# EAGLE schematic Arch Max (EAGLE 6.4)
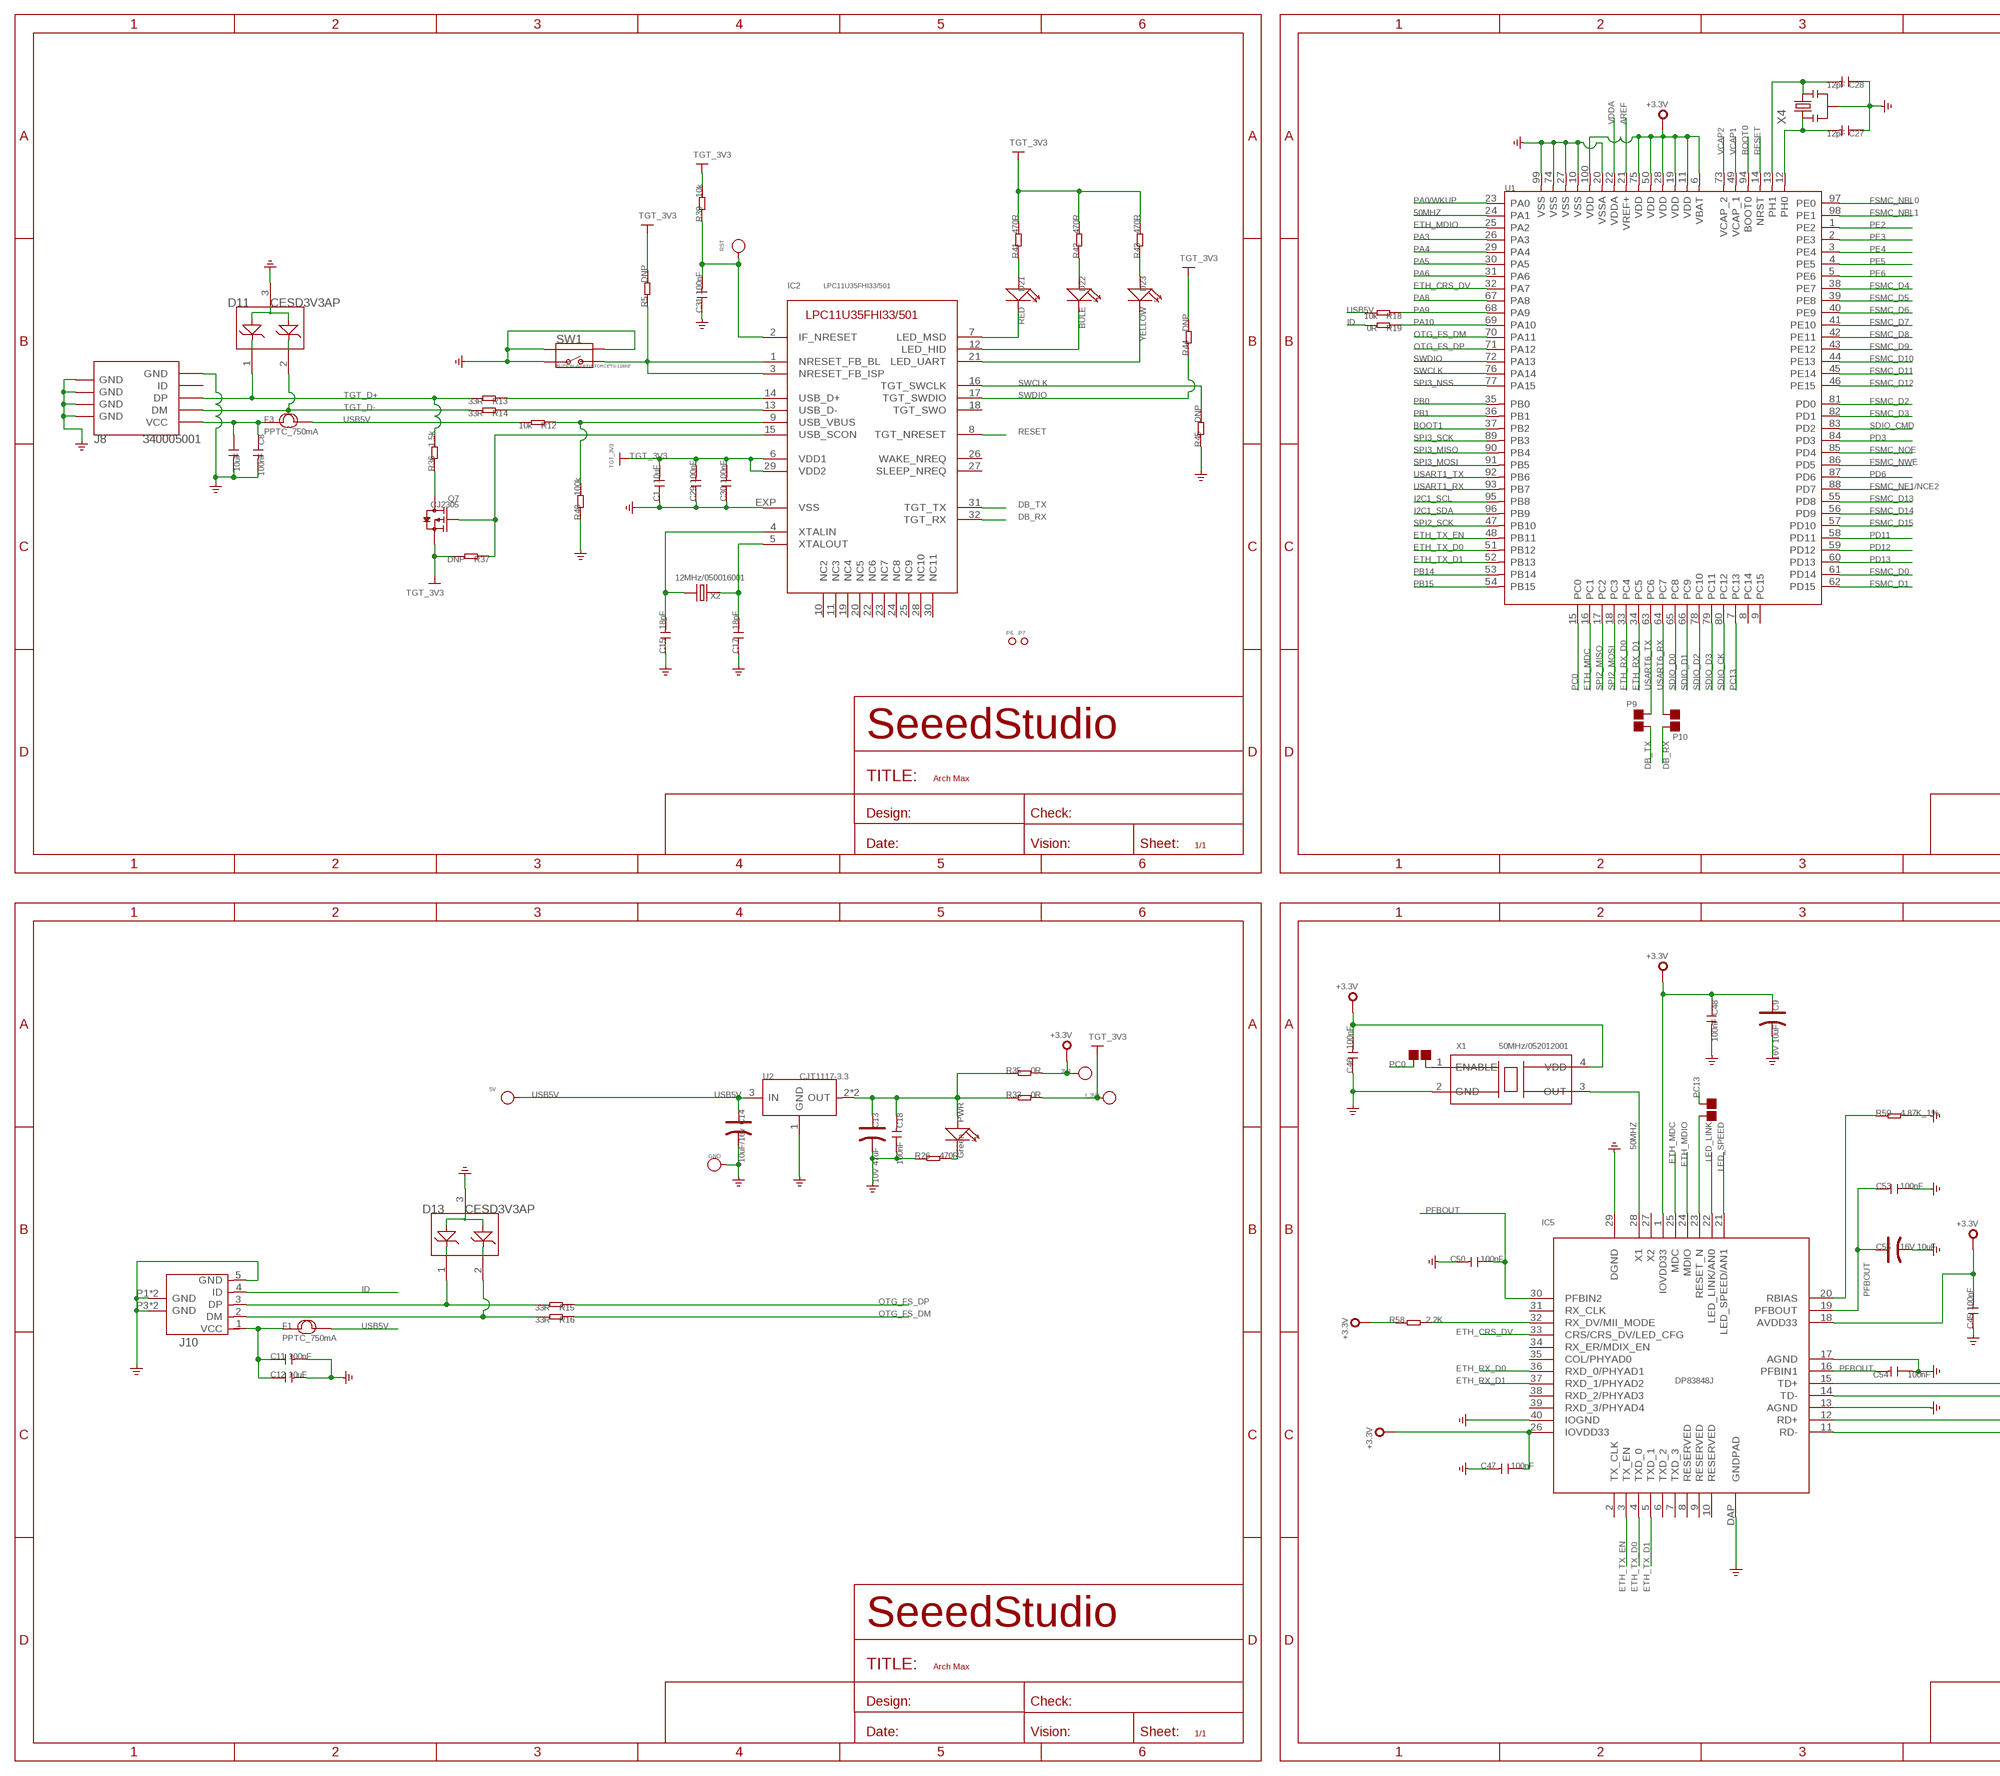
[diagram p0: schematic, sheet 1, part 1 of 2]
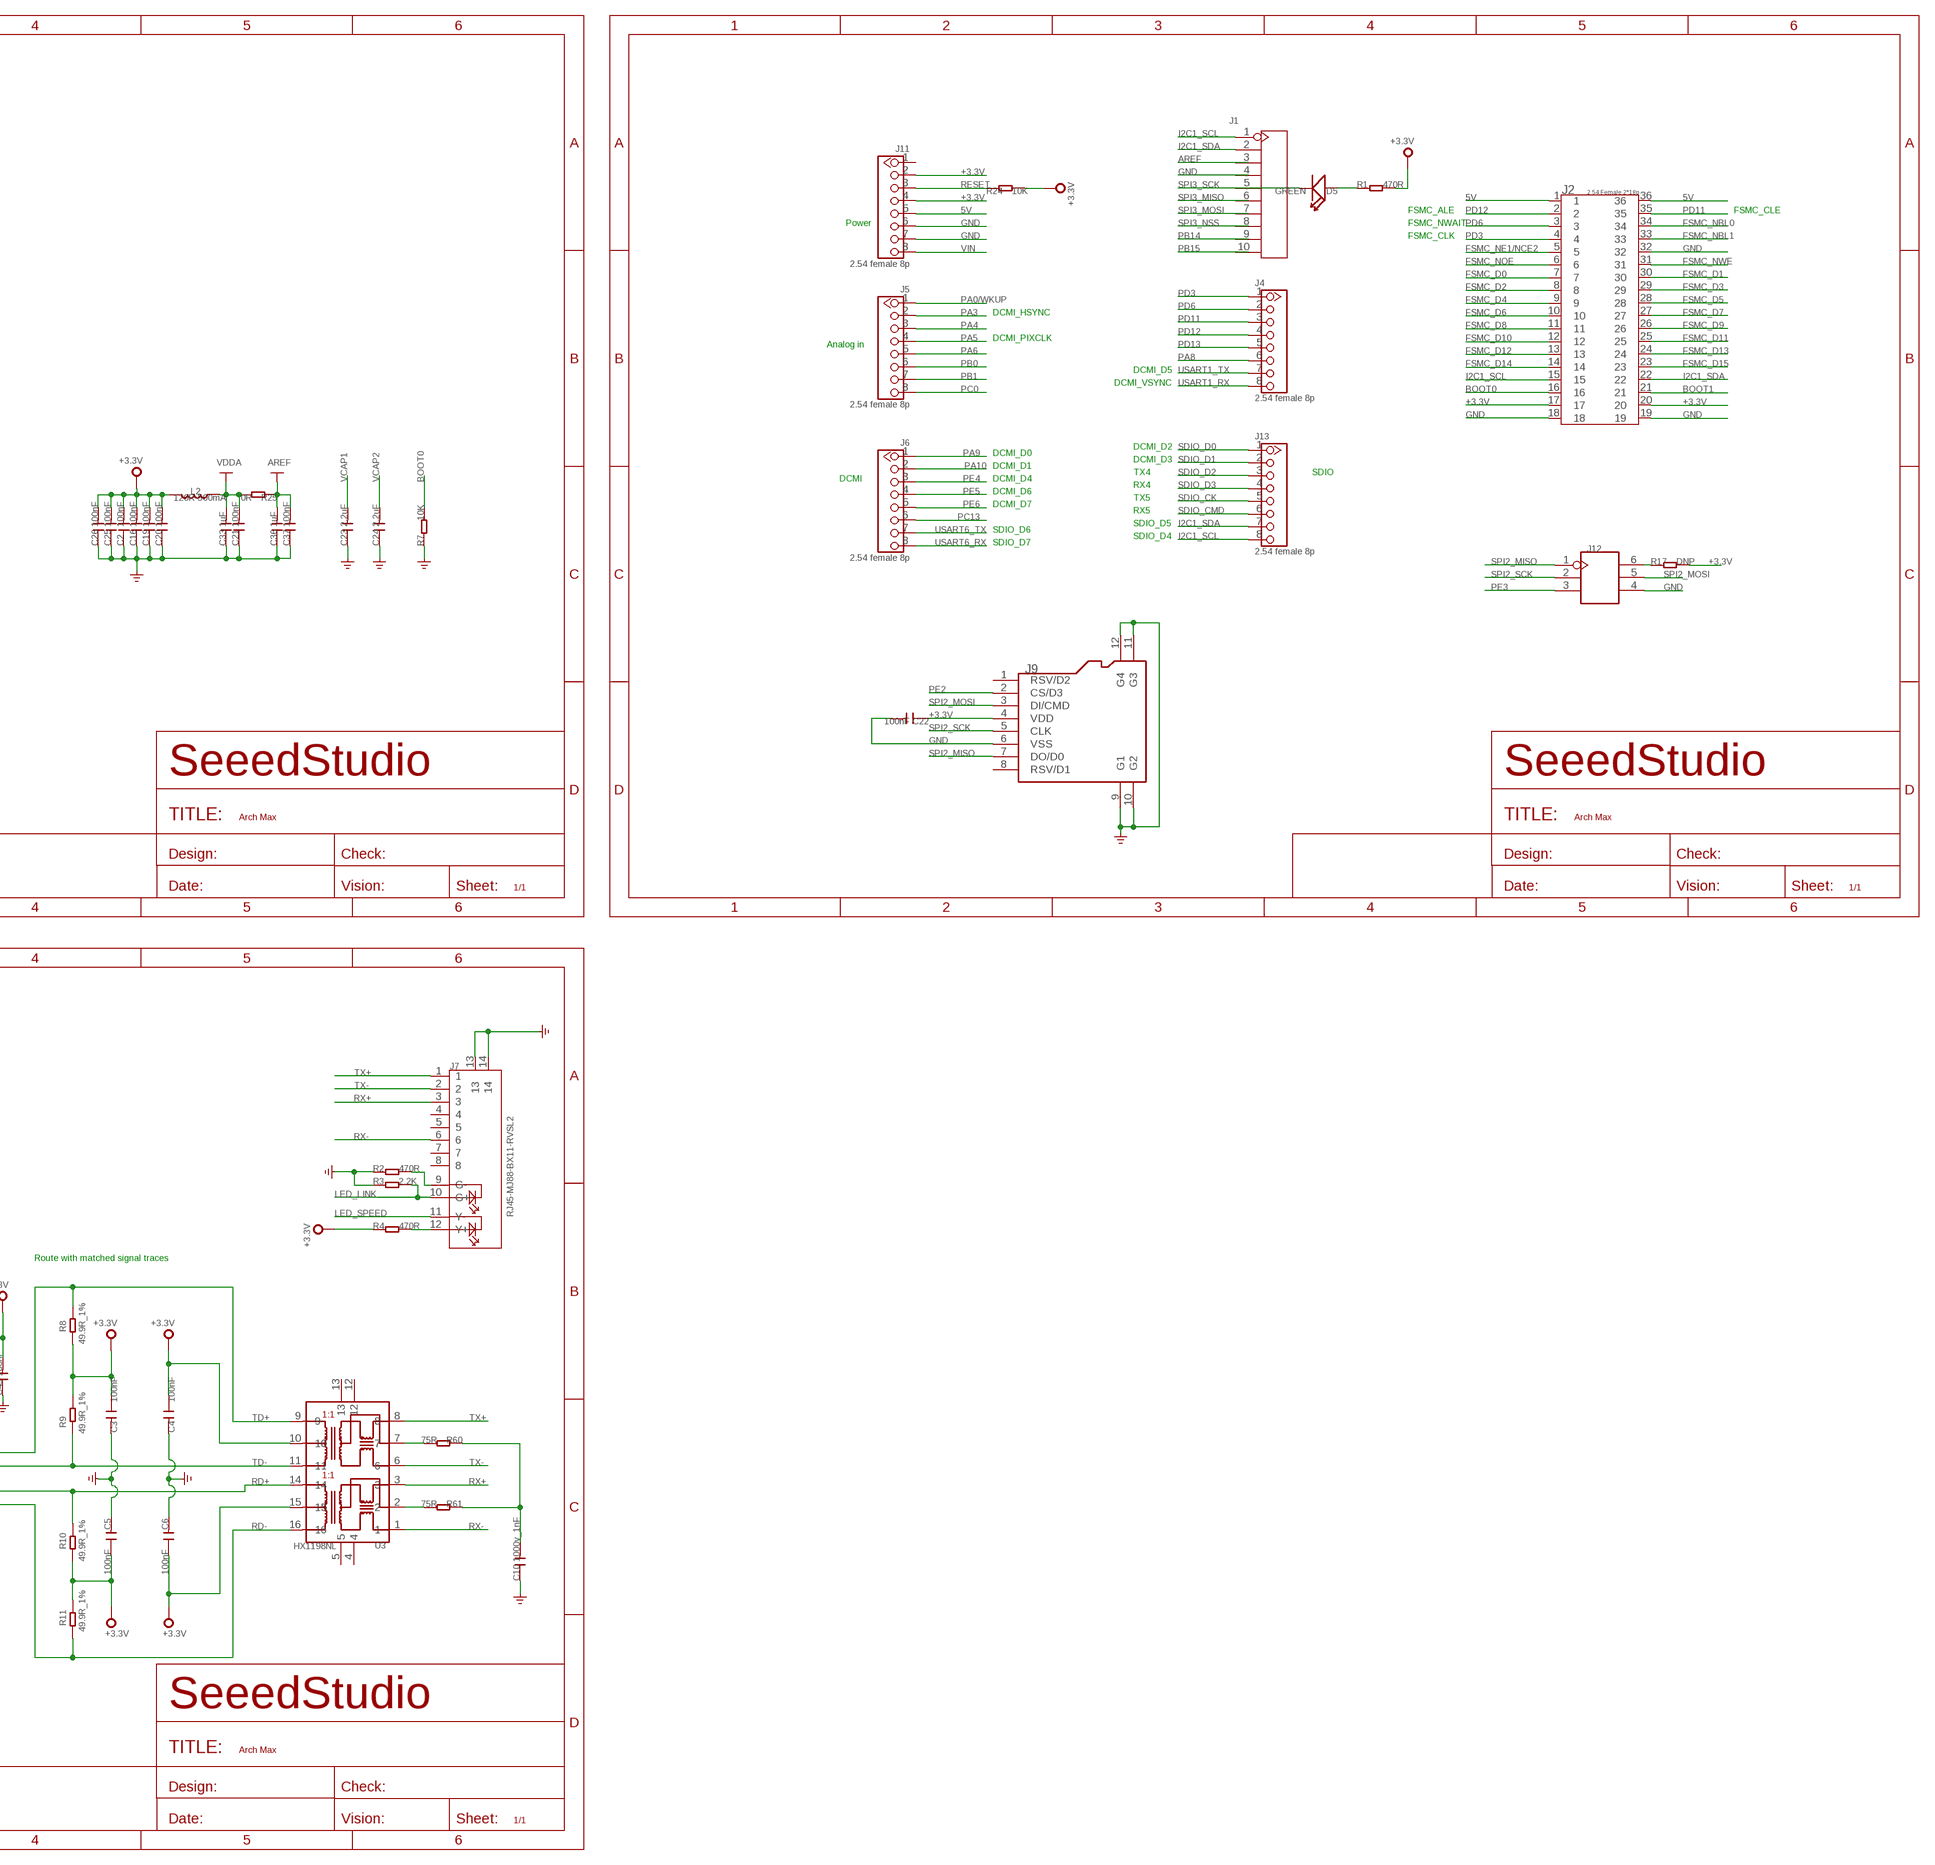
[diagram p1: schematic, sheet 1, part 2 of 2]

## Parts
3V3  PAD-TEST-POINT'4545'  [TP_4545]
5V  PAD-TEST-POINT'4545'  [TP_4545]
C1  10uF  C-0805  [C0805]
C2  100nF  C-0603  [C0603]
C3  100nF  C-0603  [C0603]
C4  100nF  C-0603  [C0603]
C5  100nF  C-0603  [C0603]
C6  100nF  C-0603  [C0603]
C7  10uF  C-0805  [C0805]
C8  100nF  C-0603  [C0603]
C9  16V 10uF  CAP-AVX-A  [AVX-A]
C10  1000v_1nF  C-1206  [C1206]
C11  100nF  C-0603  [C0603]
C12  10uF  C-0805  [C0805]
C13  10V 47uF  CAP-AVX-B  [AVX-B]
C14  10uF/16v  CAP-AVX-A  [AVX-A]
C15  18pF  C-0603  [C0603]
C16  100nF  C-0603  [C0603]
C17  18pF  C-0603  [C0603]
C18  100nF  C-0603  [C0603]
C19  100nF  C-0603  [C0603]
C20  100nF  C-0603  [C0603]
C21  100nF  C-0603  [C0603]
C22  100nF  C-0603  [C0603]
C23  2.2uF  C-0603  [C0603]
C24  2.2uF  C-0603  [C0603]
C25  100nF  C-0603  [C0603]
C26  100nF  C-0603  [C0603]
C27  12pF  C-0603  [C0603]
C28  12pF  C-0603  [C0603]
C29  100nF  C-0603  [C0603]
C30  100nF  C-0603  [C0603]
C31  100nF  C-0603  [C0603]
C33  1uF  C-0603  [C0603]
C36  1uF  C-0603  [C0603]
C37  100nF  C-0603  [C0603]
C45  100nF  C-0603  [C0603]
C46  100nF  C-0603  [C0603]
C47  100nF  C-0603  [C0603]
C48  100nF  C-0603  [C0603]
C50  100nF  C-0603  [C0603]
C53  100nF  C-0603  [C0603]
C54  100nF  C-0603  [C0603]
C55  16V 10uF  CAP-AVX-A  [AVX-A]
D5  GREEN  LED'0603'  [LED-0603]
D11  CESD3V3AP  D-ESD-3P  [SOT23]
D13  CESD3V3AP  D-ESD-3P  [SOT23]
D21  RED  LED'0603'  [LED-0603]
D22  BULE  LED'0603'  [LED-0603]
D23  YELLOW  LED'0603'  [LED-0603]
F1  PPTC_750mA  FUSE'1206'  [F1206]
F3  PPTC_750mA  FUSE'1206'  [F1206]
GND  PAD-TEST-POINT'4545'  [TP_4545]
I_3V3  PAD-TEST-POINT'4545'  [TP_4545]
IC2  LPC11U35FHI33/501  MBED-ICS_IF-LPC11U35  [MBED-ICS_HVQFN33]
IC5  DP83848J  [LLP-40]
J1  HEADER-10P-2.54  [10P-2.54-65/35MIL]
J2  2.54 Female 2*18p  HEADER-2X18P  [2.54-2X18P]
J4  2.54 female 8p  HEADER-8P2.54  [CK_1X8]
J5  2.54 female 8p  HEADER-8P2.54  [CK_1X8]
J6  2.54 female 8p  HEADER-8P2.54  [CK_1X8]
J7  RJ45-MJ88-BX11-RVSL2  [RJ45-MJ88-BX11-RVSL2]
J8  340005001  USB-MINIUSB-5P-MICRO  [MICRO-USB]
J9  HOLDER-MICROSD-8P  [8P-SMD]
J10  USB-MICRO-5P'AB'  [MICRO-USB-5P-AB]
J11  2.54 female 8p  HEADER-8P2.54  [CK_1X8]
J12  HEADER-2X3P-65/35MIL  [2X3P-2.54-65/35MIL]
J13  2.54 female 8p  HEADER-8P2.54  [CK_1X8]
L2  120R-500mA  L'0603'  [L0603]
P1  PAD-JUMPER-2P  [2P-SMD-1.78X1.27]
P5  PAD-JUMPER-2P  [2P-SMD-1.78X1.27]
P6  PAD-MARK'ANNULAR'  [ROUND-MARK-1.0]
P7  PAD-MARK'ANNULAR'  [ROUND-MARK-1.0]
P9  PAD-JUMPER-2P  [2P-SMD-1.78X1.27]
P10  PAD-JUMPER-2P  [2P-SMD-1.78X1.27]
PWR  Green  LED'0603'  [LED-0603]
Q7  CJ2305  MOSFET-P'SI2323CDS/SI2305DS<BR>'  [SOT23]
R1  470R  R-0603  [R0603]
R2  470R  R-0603  [R0603]
R3  2.2K  R-0603  [R0603]
R4  470R  R-0603  [R0603]
R5  DNP  R-0603  [R0603]
R7  10K  R-0603  [R0603]
R8  49.9R_1%  R-0603  [R0603]
R9  49.9R_1%  R-0603  [R0603]
R10  49.9R_1%  R-0603  [R0603]
R11  49.9R_1%  R-0603  [R0603]
R12  10k  R-0603  [R0603]
R13  33R  R-0603  [R0603]
R14  33R  R-0603  [R0603]
R15  33R  R-0603  [R0603]
R16  33R  R-0603  [R0603]
R17  DNP  R-0603  [R0603]
R18  10k  R-0603  [R0603]
R19  0R  R-0603  [R0603]
R24  10K  R-0603  [R0603]
R25  0R  R-0603  [R0603]
R26  470R  R-0603  [R0603]
R33  0R  R-0603  [R0603]
R35  0R  R-0603  [R0603]
R36  1.5k  R-0603  [R0603]
R37  DNP  R-0603  [R0603]
R39  10k  R-0603  [R0603]
R40  100k  R-0603  [R0603]
R41  470R  R-0603  [R0603]
R42  470R  R-0603  [R0603]
R43  470R  R-0603  [R0603]
R44  DNP  R-0603  [R0603]
R45  DNP  R-0603  [R0603]
R58  2.2K  R-0603  [R0603]
R59  4.87K_1%  R-0603  [R0603]
R60  75R  R-0603  [R0603]
R61  75R  R-0603  [R0603]
RST  PAD-TEST-POINT'4545'  [TP_4545]
SW1  BUTTON-4P-REINFORCE'TS-1188E'  [4P-SMD-7X3.5X3.5H]
U1  STM32F407VET6  [LQFP100]
U2  CJT1117-3.3  LD1117S  [SOT-223]
U3  HX1198NL  [SOIC16-9.53]
X1  50MHz/052012001  CRYSTAL-SPXO  [4P-SMD-5X3.2]
X2  12MHz/050016001  CRYSTAL'5032'  [2P-SMD-5X3.2]
X4  CRYSTAL-RESONATOR'SMD'  [3P-SMD-3.6X1.3]

## Nets
5V: J2.1 J2.36 J11.5
50MHZ: IC5.28(X1) U1.24(PA1) X1.3(OUT)
+3.3V: 3V3.T C2.2 C3.1 C4.1 C5.1 C6.1 C9.+ C16.2 C19.2 C20.2 C22.1 C25.2 C26.2 C45.2 C46.2 C47.1 C48.1 IC5.1(IOVDD33) IC5.18(AVDD33) IC5.26(IOVDD33) J2.17 J2.20 J9.4(VDD) J11.2 J11.4 L2.2 R1.2 R4.1 R8.1 R9.2 R10.1 R11.2 R17.2 R24.2 R35.1 R58.1 U1.6(VBAT) U1.11(VDD) U1.19(VDD) U1.28(VDD) U1.50(VDD) U1.75(VDD) U1.100(VDD) U3.10 U3.15 X1.4(VDD)
AREF: C36.2 C37.2 J1.3 R25.1 U1.21(VREF+)
BOOT0: J2.16 R7.2 U1.94(BOOT0)
BOOT1: J2.21 U1.37(PB2)
DB_RX: IC2.32(TGT_RX) P10.2
DB_TX: IC2.31(TGT_TX) P9.1
ETH_CRS_DV: IC5.33(CRS/CRS_DV/LED_CFG) U1.32(PA7)
ETH_MDC: IC5.25(MDC) U1.16(PC1)
ETH_MDIO: IC5.24(MDIO) U1.25(PA2)
ETH_RX_D0: IC5.36(RXD_0/PHYAD1) U1.33(PC4)
ETH_RX_D1: IC5.37(RXD_1/PHYAD2) U1.34(PC5)
ETH_TX_D0: IC5.4(TXD_0) U1.51(PB12)
ETH_TX_D1: IC5.5(TXD_1) U1.52(PB13)
ETH_TX_EN: IC5.3(TX_EN) U1.48(PB11)
FSMC_D0: J2.7 U1.61(PD14)
FSMC_D1: J2.30 U1.62(PD15)
FSMC_D2: J2.8 U1.81(PD0)
FSMC_D3: J2.29 U1.82(PD1)
FSMC_D4: J2.9 U1.38(PE7)
FSMC_D5: J2.28 U1.39(PE8)
FSMC_D6: J2.10 U1.40(PE9)
FSMC_D7: J2.27 U1.41(PE10)
FSMC_D8: J2.11 U1.42(PE11)
FSMC_D9: J2.26 U1.43(PE12)
FSMC_D10: J2.12 U1.44(PE13)
FSMC_D11: J2.25 U1.45(PE14)
FSMC_D12: J2.13 U1.46(PE15)
FSMC_D13: J2.24 U1.55(PD8)
FSMC_D14: J2.14 U1.56(PD9)
FSMC_D15: J2.23 U1.57(PD10)
FSMC_NBL0: J2.34 U1.97(PE0)
FSMC_NBL1: J2.33 U1.98(PE1)
FSMC_NE1/NCE2: J2.5 U1.88(PD7)
FSMC_NOE: J2.6 U1.85(PD4)
FSMC_NWE: J2.31 U1.86(PD5)
GND: C1.1 C2.1 C3.2 C4.2 C5.2 C6.2 C7.2 C8.2 C9.- C10.1 C11.2 C12.2 C13.- C14.- C15.1 C16.1 C17.1 C18.1 C19.1 C20.1 C21.1 C22.2 C23.1 C24.1 C25.1 C26.1 C27.1 C28.1 C29.1 C30.1 C31.1 C33.1 C36.1 C37.1 C45.1 C46.1 C47.2 C48.2 C50.2 C53.1 C54.1 C55.- D11.3 D13.3 GND.T IC2.EXP(VSS) IC5.13(AGND) IC5.17(AGND) IC5.29(DGND) IC5.40(IOGND) IC5.DAP(GNDPAD) J1.4 J2.18 J2.19 J2.32 J7.13 J7.14 J8.5(GND) J8.S1(GND) J8.S2(GND) J8.S3(GND) J8.S4(GND) J8.S5(GND) J8.S6(GND) J9.6(VSS) J9.9(G1) J9.10(G2) J9.11(G3) J9.12(G4) J10.5(GND) J10.P1(GND) J10.P2(GND) J10.P3(GND) J10.P4(GND) J11.6 J11.7 J12.4 R2.1 R3.1 R7.1 R26.1 R40.1 R45.1 R59.2 SW1.1 SW1.S1 SW1.S2 U1.10(VSS) U1.20(VSSA) U1.27(VSS) U1.74(VSS) U1.99(VSS) U2.1(GND) X1.2(GND) X4.2
GREEN: D22.- IC2.12(LED_HID)
GREEN1: D21.- IC2.7(LED_MSD)
I2C1_SCL: J1.1 J2.15 J13.8 U1.95(PB8)
I2C1_SDA: J1.2 J2.22 J13.7 U1.96(PB9)
ID: J10.4(ID) R19.2
LED_LINK: IC5.22(LED_LINK/AN0) J7.10(G+) R3.2
LED_SPEED: IC5.21(LED_SPEED/AN1) J7.11(Y-)
N$1: C11.1 C12.1 F1.1 J10.1(VCC)
N$2: J12.6 R17.1
N$3: IC2.1(NRESET_FB_BL) IC2.3(NRESET_FB_ISP) R5.1 SW1.2
N$4: IC5.23(RESET_N) P1.2
N$5: IC2.9(USB_VBUS) R12.1 R40.2
N$6: J7.9(G-) R2.2
N$7: J7.12(Y+) R4.2
N$8: D5.+ R1.1
N$9: P5.2 X1.1(ENABLE)
N$10: C7.1 C8.1 F3.1 J8.1(VCC)
N$12: IC2.14(USB_D+) R13.1
N$13: IC2.13(USB_D-) R14.1
N$15: D13.1 J10.3(DP) R15.2
N$18: PWR.- R26.2
N$22: D13.2 J10.2(DM) R16.2
N$23: C13.+ C18.2 PWR.+ R33.1 R35.2 U2.2(OUT) U2.TER(OUT)
N$24: C31.2 IC2.2(IF_NRESET) R39.1 RST.T
N$25: IC2.15(USB_SCON) Q7.1(G) R37.1
N$26: D22.+ R42.1
N$27: Q7.3(D) R36.1
N$28: D21.+ R41.1
N$32: D23.- IC2.21(LED_UART)
N$33: D23.+ R43.1
N$34: C15.2 IC2.4(XTALIN) X2.2
N$37: C17.2 IC2.5(XTALOUT) X2.1
N$56: R61.2 U3.2
N$58: R60.2 U3.7
N$59: C10.2 R60.1 R61.1
N$123: IC5.20(RBIAS) R59.1
N$127: IC5.32(RX_DV/MII_MODE) R58.2
OTG_FS_DM: R16.1 U1.70(PA11)
OTG_FS_DP: R15.1 U1.71(PA12)
PA0/WKUP: J5.1 U1.23(PA0)
PA3: J5.2 U1.26(PA3)
PA4: J5.3 U1.29(PA4)
PA5: J5.4 U1.30(PA5)
PA6: J5.5 U1.31(PA6)
PA8: J4.6 U1.67(PA8)
PA9: J6.1 R18.1 U1.68(PA9)
PA10: J6.2 R19.1 U1.69(PA10)
PB0: J5.6 U1.35(PB0)
PB1: J5.7 U1.36(PB1)
PB14: J1.9 U1.53(PB14)
PB15: J1.10 U1.54(PB15)
PC0: J5.8 P5.1 U1.15(PC0)
PC13: J6.6 P1.1 U1.7(PC13)
PD3: J2.4 J4.1 U1.84(PD3)
PD6: J2.3 J4.2 U1.87(PD6)
PD11: J2.35 J4.3 U1.58(PD11)
PD12: J2.2 J4.4 U1.59(PD12)
PD13: J4.5 U1.60(PD13)
PE2: J9.2(CS/D3) U1.1(PE2)
PE3: J12.3 U1.2(PE3)
PE4: J6.3 U1.3(PE4)
PE5: J6.4 U1.4(PE5)
PE6: J6.5 U1.5(PE6)
PFBOUT: C50.1 C53.2 C54.2 C55.+ IC5.16(PFBIN1) IC5.19(PFBOUT) IC5.30(PFBIN2)
RD+: IC5.12(RD+) R10.2 U3.14
RD-: IC5.11(RD-) R11.1 U3.16
RESET: IC2.8(TGT_NRESET) J11.3 R24.1 U1.14(NRST)
RX+: J7.3 U3.3
RX-: J7.6 U3.1
SDIO_CK: J13.5 U1.80(PC12)
SDIO_CMD: J13.6 U1.83(PD2)
SDIO_D0: J13.1 U1.65(PC8)
SDIO_D1: J13.2 U1.66(PC9)
SDIO_D2: J13.3 U1.78(PC10)
SDIO_D3: J13.4 U1.79(PC11)
SPI2_MISO: J9.7(DO/D0) J12.1 U1.17(PC2)
SPI2_MOSI: J9.3(DI/CMD) J12.5 U1.18(PC3)
SPI2_SCK: J9.5(CLK) J12.2 U1.47(PB10)
SPI3_MISO: J1.6 U1.90(PB4)
SPI3_MOSI: J1.7 U1.91(PB5)
SPI3_NSS: J1.8 U1.77(PA15)
SPI3_SCK: D5.- J1.5 U1.89(PB3)
SWCLK: IC2.16(TGT_SWCLK) R45.2 U1.76(PA14)
SWDIO: IC2.17(TGT_SWDIO) R44.1 U1.72(PA13)
TD+: IC5.15(TD+) R8.2 U3.9
TD-: IC5.14(TD-) R9.1 U3.11
TGT_3V3: C1.2 C29.2 C30.2 I_3V3.T IC2.6(VDD1) IC2.29(VDD2) Q7.2(S) R5.2 R33.2 R37.2 R39.2 R41.2 R42.2 R43.2 R44.2
TGT_D+: D11.1 J8.3(DP) R13.2 R36.2
TGT_D-: D11.2 J8.2(DM) R14.2
TX+: J7.1 U3.8
TX-: J7.2 U3.6
USART1_RX: J4.8 U1.93(PB7)
USART1_TX: J4.7 U1.92(PB6)
USART6_RX: J6.8 P10.1 U1.64(PC7)
USART6_TX: J6.7 P9.2 U1.63(PC6)
USB5V: 5V.T C14.+ F1.2 F3.2 R12.2 R18.2 U2.3(IN)
VCAP1: C23.2 U1.49(VCAP_1)
VCAP2: C24.2 U1.73(VCAP_2)
VDDA: C21.2 C33.2 L2.1 R25.2 U1.22(VDDA)
VIN: J11.8
XTALIN: C27.2 U1.12(PH0) X4.1
XTALOUT: C28.2 U1.13(PH1) X4.3
Unconnected: IC2.10(NC2) IC2.11(NC3) IC2.18(TGT_SWO) IC2.19(NC4) IC2.20(NC5) IC2.22(NC6) IC2.23(NC7) IC2.24(NC8) IC2.25(NC9) IC2.26(WAKE_NREQ) IC2.27(SLEEP_NREQ) IC2.28(NC10) IC2.30(NC11) IC5.2(TX_CLK) IC5.6(TXD_2) IC5.7(TXD_3) IC5.8(RESERVED) IC5.9(RESERVED) IC5.10(RESERVED) IC5.27(X2) IC5.31(RX_CLK) IC5.34(RX_ER/MDIX_EN) IC5.35(COL/PHYAD0) IC5.38(RXD_2/PHYAD3) IC5.39(RXD_3/PHYAD4) J7.4 J7.5 J7.7 J7.8 J8.4(ID) J9.1(RSV/D2) J9.8(RSV/D1) J11.1 U1.8(PC14) U1.9(PC15) U3.4 U3.5 U3.12 U3.13

## Notes on the sheet
- FSMC_ALE | FSMC_CLE
- Power | FSMC_NWAIT
- FSMC_CLK
- DCMI_HSYNC
- DCMI_PIXCLK
- Analog in
- DCMI_D5
- DCMI_VSYNC
- DCMI_D2
- DCMI_D0
- DCMI_D3
- DCMI_D1
- TX4 | SDIO
- DCMI | DCMI_D4
- RX4
- DCMI_D6
- TX5
- DCMI_D7
- RX5
- SDIO_D5
- SDIO_D6
- SDIO_D4
- SDIO_D7
- Route with matched signal traces

## Library data of the parts
3V3 5V GND I_3V3 RST = Discrete:PAD-TEST-POINT; PARTNO: DNP
C1-C8 C10-C12 C15-C31 C33 C36 C37 C45-C48 C50 C53 C54 = Discrete:C*: Ceramic Capacitors
C9 C13 C14 C55 = Discrete:CAP*: Electrolytic Capacitors,Tantalum Capacitors and Super Capacitors
D5 D21-D23 PWR = Discrete:LED*
D11 D13 = Discrete:D-ESD-3P
F1 F3 = Discrete:FUSE
IC2 = Arch_M4:MBED-ICS_IF-LPC11U35
IC5 = mbed:DP83848J: National Semiconductor DP83848J PHYTER Mini LS Single Port 10/100 Ethernet Transceiver
J1 = Connector-new:HEADER-10P
J2 = Connector:HEADER-2X18P
J4-J6 J11 J13 = Connector:HEADER-8P
J7 = Connector:RJ45-MJ88-BX11-RVSL2: Modular Jack 8P8C,R/A,With LED
J8 = Connector :USB-MINIUSB-5P
J9 = Connector :HOLDER-MICROSD-8P
J10 = template :USB-MICRO-5P: ST-USB-001L5 The Size of ST-USB-001L5 is 8.0X2.35X5.61mm.when you use it ,you need know that the Size of pin is only 1.6MM.
J12 = Connector :HEADER-2X3P
L2 = Discrete:L*
P1 P5 P9 P10 = Discrete:PAD-JUMPER-2P; PARTNO: DNP
P6 P7 = Discrete:PAD-MARK; PARTNO: DNP
Q7 = Discrete:MOSFET-P
R1-R5 R7-R19 R24-R26 R33 R35-R37 R39-R45 R58-R61 = Discrete:R*
SW1 = Discrete:BUTTON-4P-REINFORCE: TS-1188E http://www.best-dz.com/?thread-374-2.html
U1 = template :STM32F407VET6: ARM Cortex-M4 32b MCU+FPU,210 DMIPS,up to 1MB Flash/192+4KB RAM,USB OTG HS/FS, Ethernet ,17TIMs,3ADCs,15comm.interfaces&camera
U2 = IC:LD1117: Low Drop Fixed And Adjustable Positive Voltage Regulators http://www.datasheetcatalog.org/datasheet/SGSThomsonMicroelectronics/mXuqtqv.pdf
U3 = IC:HX1198NL: 10/100BASE-T Single Port Surface Mount Magnetics With Various Turns Ratios
X1 = Discrete:CRYSTAL-SPXO
X2 = Discrete:CRYSTAL*: CRYSTAL
X4 = Discrete:CRYSTAL-RESONATOR: Resonator Small SMD resonator. This is the itty bitty 10/20MHz resonators with built in caps. CSTCE10M0G55 and CSTCE20M0V53. Footprint has been reviewed closely but hasn't been tested yet.

## Net classes
0 default: width 0.102 mm, drill 0.203 mm, clearance 0.102 mm